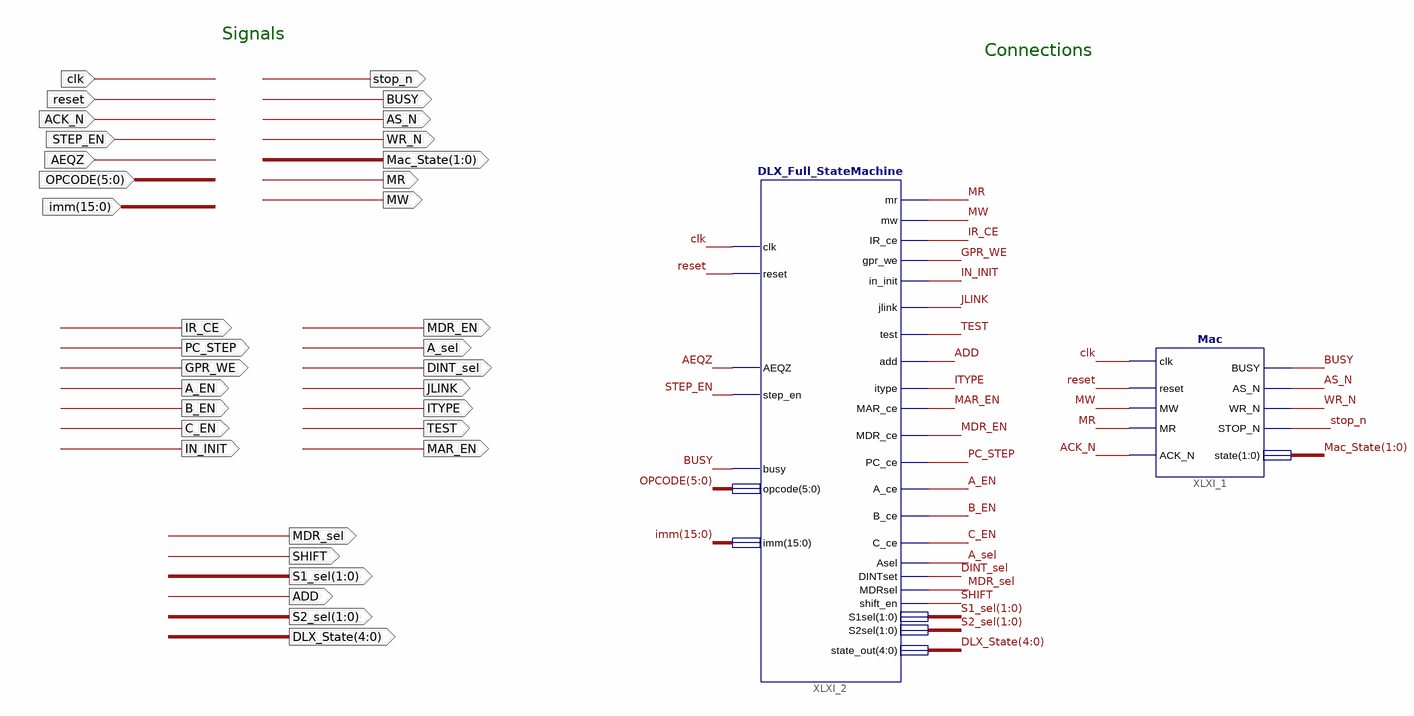
[diagram p0: schematic sheet 1]
// Xilinx ISE schematic DLX_Full_Control.sch (spartan6) as structural Verilog: 2 symbols, 34 ports
module DLX_Full_Control (
  input  clk,
  input  reset,
  input  ACK_N,
  input  STEP_EN,
  input  AEQZ,
  input  [5:0] OPCODE,
  input  [15:0] imm,
  output BUSY,
  output AS_N,
  output WR_N,
  output [1:0] Mac_State,
  output MR,
  output MW,
  output IR_CE,
  output PC_STEP,
  output GPR_WE,
  output A_EN,
  output B_EN,
  output C_EN,
  output IN_INIT,
  output MDR_EN,
  output A_sel,
  output DINT_sel,
  output JLINK,
  output TEST,
  output MAR_EN,
  output MDR_sel,
  output SHIFT,
  output [1:0] S1_sel,
  output ADD,
  output [1:0] S2_sel,
  output [4:0] DLX_State,
  output ITYPE,
  output stop_n
);

  Mac XLXI_1 (
    .clk(clk), .reset(reset), .ACK_N(ACK_N), .MW(MW), .MR(MR), .STOP_N(stop_n), .BUSY(BUSY), .AS_N(AS_N),
    .WR_N(WR_N), .state(Mac_State));
  DLX_Full_StateMachine XLXI_2 (
    .mr(MR), .mw(MW), .in_init(IN_INIT), .gpr_we(GPR_WE), .IR_ce(IR_CE), .test(TEST), .add(ADD),
    .jlink(JLINK), .itype(ITYPE), .A_ce(A_EN), .B_ce(B_EN), .C_ce(C_EN), .MDR_ce(MDR_EN), .MAR_ce(MAR_EN),
    .PC_ce(PC_STEP), .Asel(A_sel), .DINTset(DINT_sel), .MDRsel(MDR_sel), .shift_en(SHIFT), .S1sel(S1_sel),
    .S2sel(S2_sel), .state_out(DLX_State), .step_en(STEP_EN), .busy(BUSY), .AEQZ(AEQZ), .opcode(OPCODE),
    .clk(clk), .reset(reset), .imm(imm));

  // Notes on the sheet:
  //   Signals
  //   Connections
endmodule
